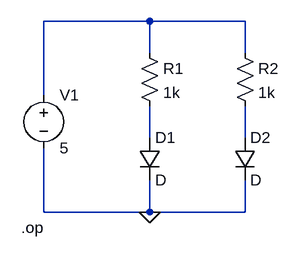
[diagram p0: schematic Calculo de IDq.asc]
Calculo de IDq.asc, the LTspice schematic file:
Version 4
SHEET 1 880 680
WIRE 160 -16 0 -16
WIRE 304 -16 160 -16
WIRE 160 32 160 -16
WIRE 304 32 304 -16
WIRE 0 96 0 -16
WIRE 160 160 160 112
WIRE 304 160 304 112
WIRE 0 272 0 176
WIRE 160 272 160 224
WIRE 160 272 0 272
WIRE 304 272 304 224
WIRE 304 272 160 272
FLAG 160 272 0
SYMBOL diode 144 160 R0
SYMATTR InstName D1
SYMBOL diode 288 160 R0
SYMATTR InstName D2
SYMBOL res 144 16 R0
SYMATTR InstName R1
SYMATTR Value 1k
SYMBOL res 288 16 R0
SYMATTR InstName R2
SYMATTR Value 1k
SYMBOL voltage 0 80 R0
WINDOW 123 0 0 Left 0
WINDOW 39 0 0 Left 0
SYMATTR InstName V1
SYMATTR Value 5
TEXT -34 296 Left 2 !.op

The netlist it stands for:
* Calculo de IDq.asc
D1 N002 0 D
D2 N003 0 D
R1 N001 N002 1k
R2 N001 N003 1k
V1 N001 0 5
.model D D
.lib standard.dio
.op
.backanno
.end